# EasyEDA Pro project ProProject_aDataFlow_v2_pub_2024-01-13.epro, schematic SCH_back
Create Date: 2023-08-07; Page Name: P1; Project Name: aDataFlow_v2; Schematic Name: SCH_back; Update Date: 2023-09-15; Company: AMAGSTY; Drawed: amagsty; Page Size: -; Part Number: -; Reviewed: -; Version: 2.2
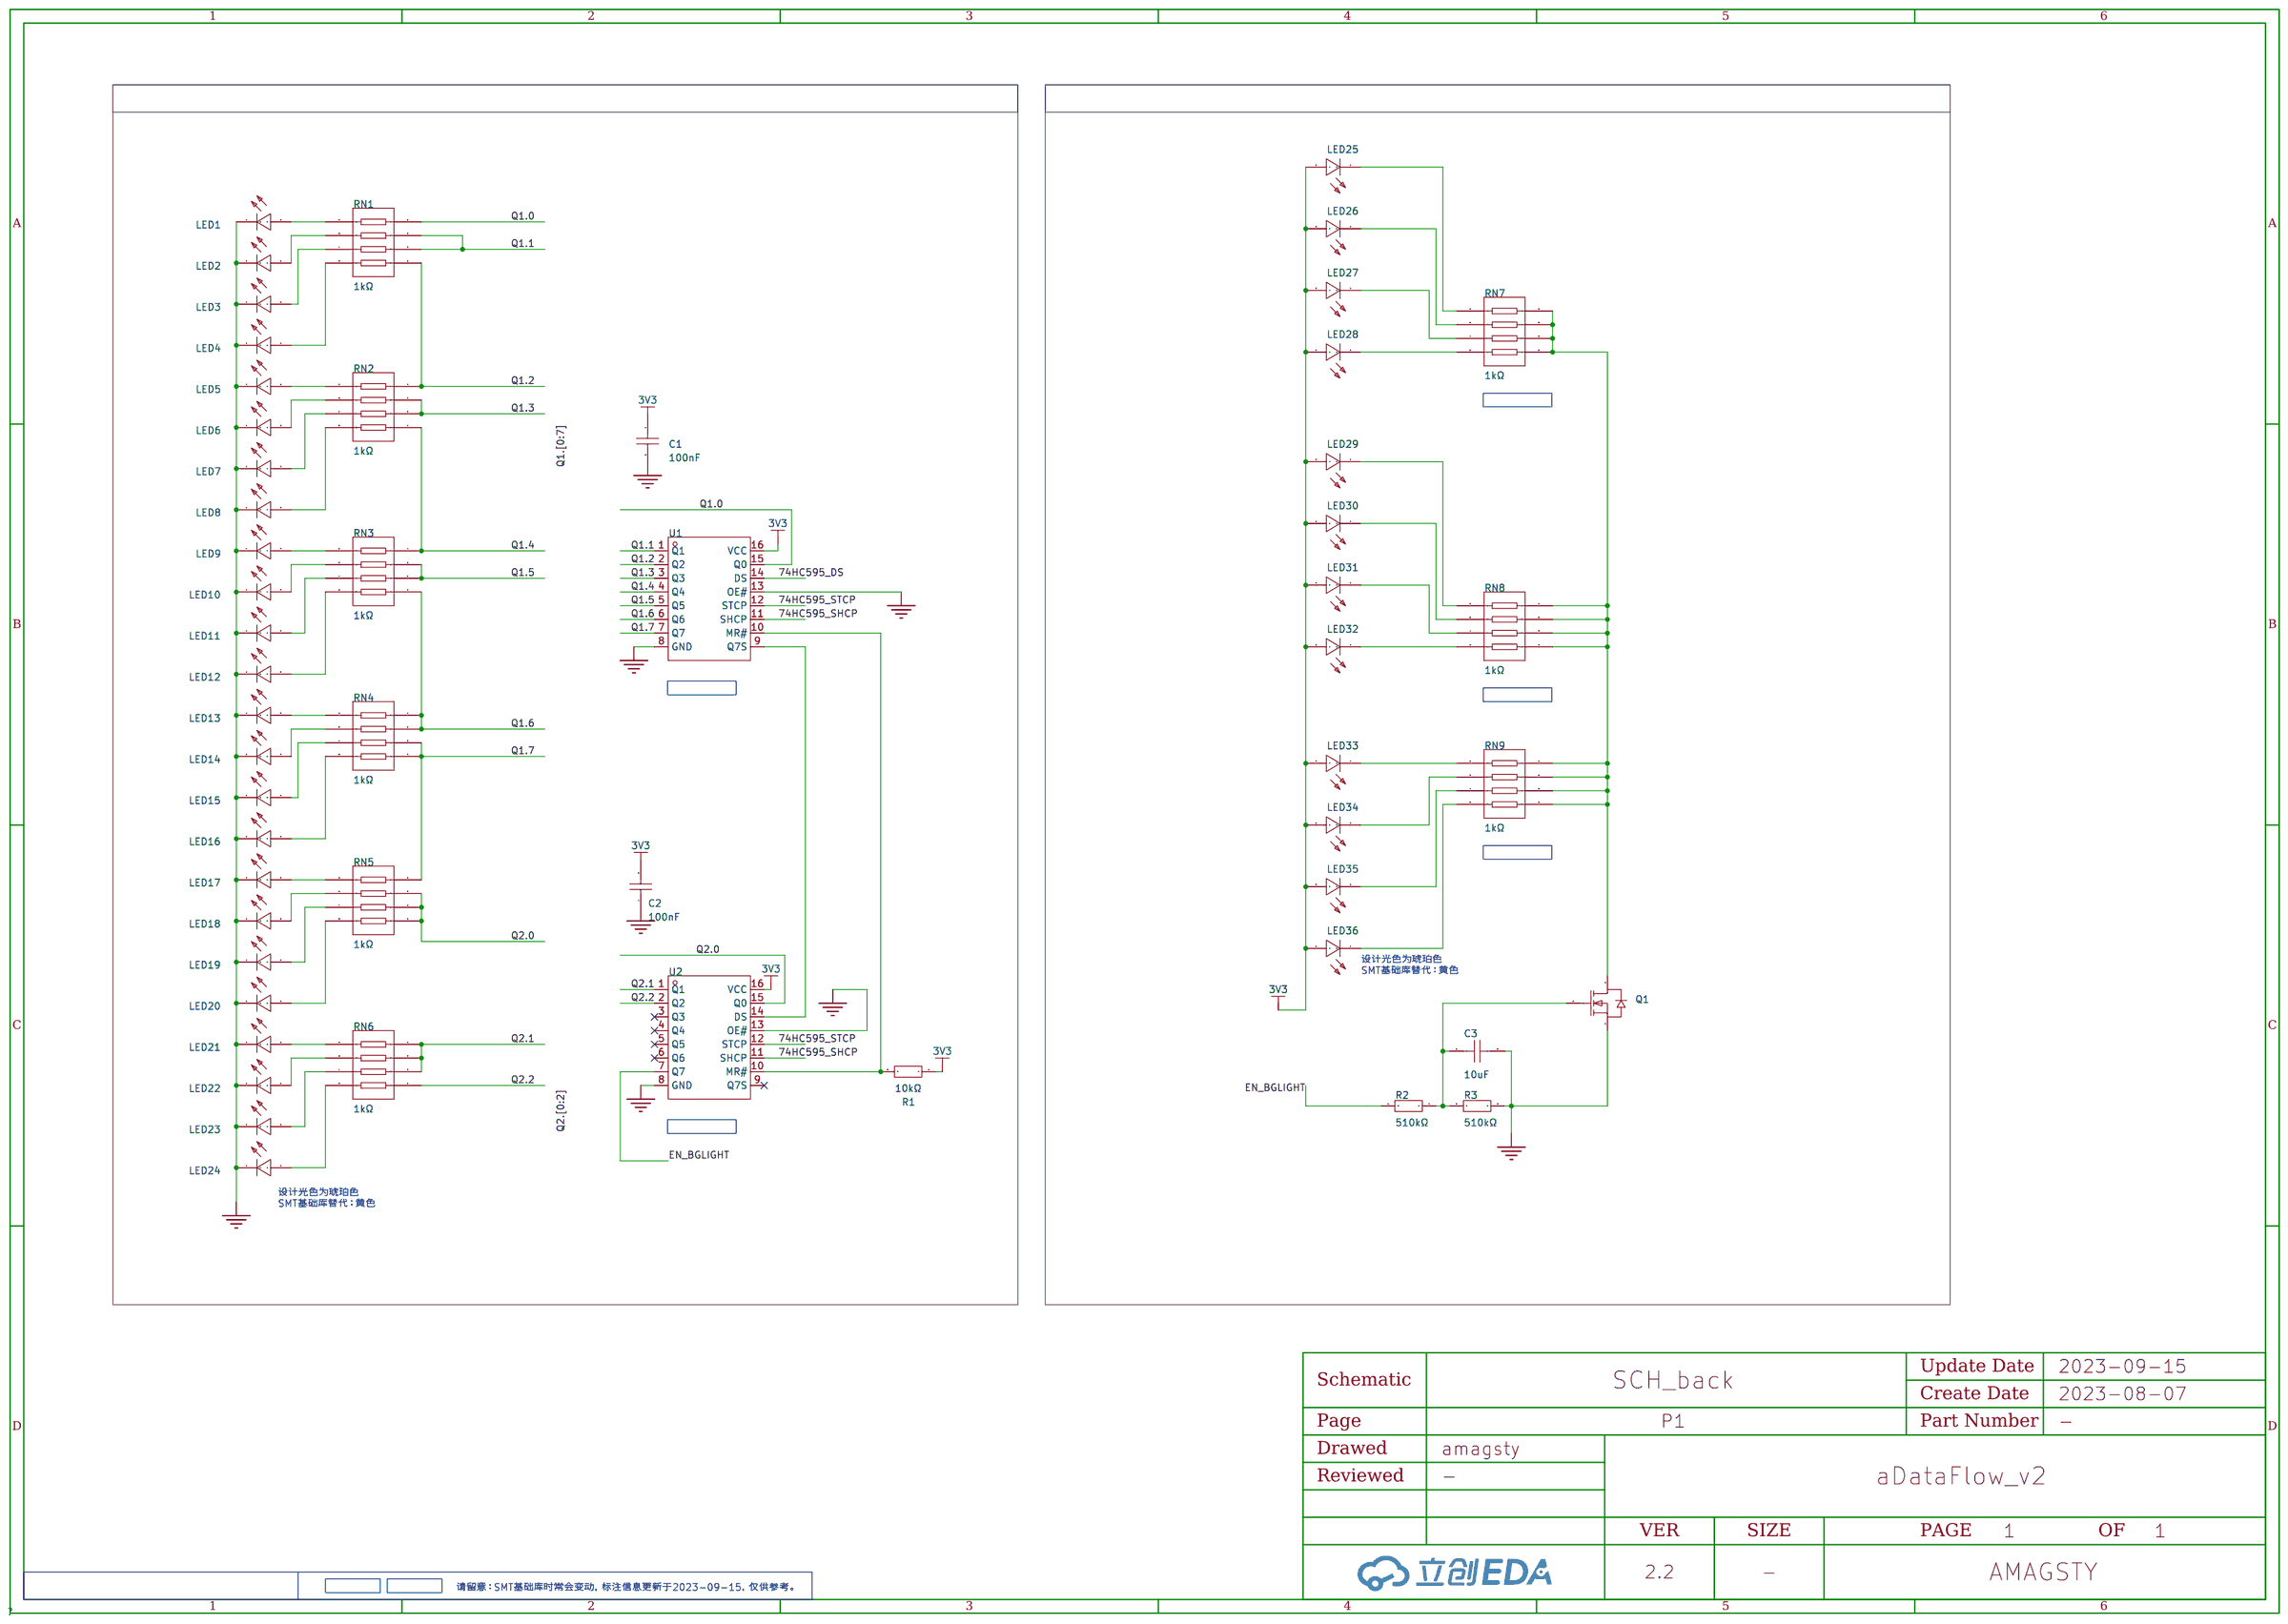
[diagram p1: schematic sheet]

## Parts
C1  100nF  [C0402]
C2  100nF  [C0402]
C3  10uF  [C0603]
LED1  19-213/Y2C-CQ2R2L/3T(CY)  [LED0603-RD-YELLOW]
LED2  19-213/Y2C-CQ2R2L/3T(CY)  [LED0603-RD-YELLOW]
LED3  19-213/Y2C-CQ2R2L/3T(CY)  [LED0603-RD-YELLOW]
LED4  19-213/Y2C-CQ2R2L/3T(CY)  [LED0603-RD-YELLOW]
LED5  19-213/Y2C-CQ2R2L/3T(CY)  [LED0603-RD-YELLOW]
LED6  19-213/Y2C-CQ2R2L/3T(CY)  [LED0603-RD-YELLOW]
LED7  19-213/Y2C-CQ2R2L/3T(CY)  [LED0603-RD-YELLOW]
LED8  19-213/Y2C-CQ2R2L/3T(CY)  [LED0603-RD-YELLOW]
LED9  19-213/Y2C-CQ2R2L/3T(CY)  [LED0603-RD-YELLOW]
LED10  19-213/Y2C-CQ2R2L/3T(CY)  [LED0603-RD-YELLOW]
LED11  19-213/Y2C-CQ2R2L/3T(CY)  [LED0603-RD-YELLOW]
LED12  19-213/Y2C-CQ2R2L/3T(CY)  [LED0603-RD-YELLOW]
LED13  19-213/Y2C-CQ2R2L/3T(CY)  [LED0603-RD-YELLOW]
LED14  19-213/Y2C-CQ2R2L/3T(CY)  [LED0603-RD-YELLOW]
LED15  19-213/Y2C-CQ2R2L/3T(CY)  [LED0603-RD-YELLOW]
LED16  19-213/Y2C-CQ2R2L/3T(CY)  [LED0603-RD-YELLOW]
LED17  19-213/Y2C-CQ2R2L/3T(CY)  [LED0603-RD-YELLOW]
LED18  19-213/Y2C-CQ2R2L/3T(CY)  [LED0603-RD-YELLOW]
LED19  19-213/Y2C-CQ2R2L/3T(CY)  [LED0603-RD-YELLOW]
LED20  19-213/Y2C-CQ2R2L/3T(CY)  [LED0603-RD-YELLOW]
LED21  19-213/Y2C-CQ2R2L/3T(CY)  [LED0603-RD-YELLOW]
LED22  19-213/Y2C-CQ2R2L/3T(CY)  [LED0603-RD-YELLOW]
LED23  19-213/Y2C-CQ2R2L/3T(CY)  [LED0603-RD-YELLOW]
LED24  19-213/Y2C-CQ2R2L/3T(CY)  [LED0603-RD-YELLOW]
LED25  19-213/Y2C-CQ2R2L/3T(CY)  [LED0603-RD-YELLOW]
LED26  19-213/Y2C-CQ2R2L/3T(CY)  [LED0603-RD-YELLOW]
LED27  19-213/Y2C-CQ2R2L/3T(CY)  [LED0603-RD-YELLOW]
LED28  19-213/Y2C-CQ2R2L/3T(CY)  [LED0603-RD-YELLOW]
LED29  19-213/Y2C-CQ2R2L/3T(CY)  [LED0603-RD-YELLOW]
LED30  19-213/Y2C-CQ2R2L/3T(CY)  [LED0603-RD-YELLOW]
LED31  19-213/Y2C-CQ2R2L/3T(CY)  [LED0603-RD-YELLOW]
LED32  19-213/Y2C-CQ2R2L/3T(CY)  [LED0603-RD-YELLOW]
LED33  19-213/Y2C-CQ2R2L/3T(CY)  [LED0603-RD-YELLOW]
LED34  19-213/Y2C-CQ2R2L/3T(CY)  [LED0603-RD-YELLOW]
LED35  19-213/Y2C-CQ2R2L/3T(CY)  [LED0603-RD-YELLOW]
LED36  19-213/Y2C-CQ2R2L/3T(CY)  [LED0603-RD-YELLOW]
Q1  AO3400A  [SOT-23-3_L2.9-W1.6-P1.90-LS2.8-BR]
R1  10kΩ  [R0402]
R2  510kΩ  [R0402]
R3  510kΩ  [R0402]
RN1  1kΩ  [RES-ARRAY-SMD_0603-8P-L3.2-W1.6-BL]
RN2  1kΩ  [RES-ARRAY-SMD_0603-8P-L3.2-W1.6-BL]
RN3  1kΩ  [RES-ARRAY-SMD_0603-8P-L3.2-W1.6-BL]
RN4  1kΩ  [RES-ARRAY-SMD_0603-8P-L3.2-W1.6-BL]
RN5  1kΩ  [RES-ARRAY-SMD_0603-8P-L3.2-W1.6-BL]
RN6  1kΩ  [RES-ARRAY-SMD_0603-8P-L3.2-W1.6-BL]
RN7  1kΩ  [RES-ARRAY-SMD_0603-8P-L3.2-W1.6-BL]
RN8  1kΩ  [RES-ARRAY-SMD_0603-8P-L3.2-W1.6-BL]
RN9  1kΩ  [RES-ARRAY-SMD_0603-8P-L3.2-W1.6-BL]
U1  74HC595D,118  [SOIC-16_L9.9-W3.9-P1.27-LS6.0-BL]
U2  74HC595D,118  [SOIC-16_L9.9-W3.9-P1.27-LS6.0-BL]

## Library data of the parts
C1 C2 = CL05B104KO5NNNC: 容值:100nF;精度:±10%;额定电压:16V;材质(温度系数):X7R;; LCSC Part Name: 100nF ±10% 16V; Supplier Part: C1525; Manufacturer: SAMSUNG(三星); Supplier Footprint: 0402; JLCPCB Part Class: 基础库; Datasheet: https://atta.szlcsc.com/upload/public/pdf/source/20160103/1457707674891.pdf; Supplier: LCSC; Tolerance: ±10%; Voltage Rated: 16V; Temperature Coefficient: X7R
C3 = CL10A106KP8NNNC: 容值:10uF;精度:±10%;额定电压:10V;材质(温度系数):X5R;; LCSC Part Name: 10uF ±10% 10V; Supplier Part: C19702; Manufacturer: SAMSUNG(三星); Supplier Footprint: 0603; JLCPCB Part Class: 基础库; Datasheet: https://atta.szlcsc.com/upload/public/pdf/source/20160103/1457707703378.pdf; Supplier: LCSC; Tolerance: ±10%; Voltage Rated: 10V; Temperature Coefficient: X5R
LED1-LED36 = 19-213/Y2C-CQ2R2L/3T(CY): 发光颜色:黄灯;二极管配置:-;主波长:585.5nm~591.5nm;色温:-;功率:60mW;安装方式:-;; LCSC Part Name: 黄灯; Supplier Part: C72038; Manufacturer: EVERLIGHT(亿光); Supplier Footprint: 0603; JLCPCB Part Class: 基础库; Datasheet: https://atta.szlcsc.com/upload/public/pdf/source/20160507/1462613613586.pdf; Supplier: LCSC; Emitted Color: 黄灯; Lens Color: 无色透明; Dominant Wavelength: 585.5nm~591.5nm; Peak Wavelength: 591nm; Forward Current: 20mA; Power Dissipation: 60mW; Viewing Angle: 120°; Operating Temperature: -40℃~+85℃
Q1 = AO3400A_C20917: 类型:N沟道;漏源电压(Vdss):30V;连续漏极电流(Id):5.7A;功率(Pd):1.4W;导通电阻(RDS(on)@Vgs,Id):26.5mΩ@10V,5.7A;; LCSC Part Name: N沟道 30V 5.7A; Supplier Part: C20917; Manufacturer: AOS; Supplier Footprint: SOT-23-3L; JLCPCB Part Class: Basic Part; Datasheet: https://atta.szlcsc.com/upload/public/pdf/source/20140107/1457706668533.pdf; Supplier: LCSC; Type: N沟道; Drain Source Voltage (Vdss): 30V; Continuous Drain Current (Id): 5.7A; Power Dissipation (Pd): 1.4W; Drain Source On Resistance (RDS(on)@Vgs,Id): 26.5mΩ@10V,5.7A; Gate Threshold Voltage (Vgs(th)@Id): 1.5V@250uA
R1 = 0402WGF1002TCE: 电阻类型:厚膜电阻;阻值:10kΩ;精度:±1%;功率:62.5mW;; LCSC Part Name: 10kΩ ±1% 62.5mW; Supplier Part: C25744; Manufacturer: UNI-ROYAL(厚声); Supplier Footprint: 0402; JLCPCB Part Class: 基础库; Datasheet: https://atta.szlcsc.com/upload/public/pdf/source/20200306/C422600_1E6D84923E4A46A82E41ADD87F860B5C.pdf; Supplier: LCSC; Type: 厚膜电阻; Tolerance: ±1%; Power(Watts): 62.5mW; Temperature Coefficient: ±100ppm/℃; Overload Voltage (Max): 50V; Operating Temperature Range: -55℃~+155℃
R2 R3 = 0402WGF5103TCE: 电阻类型:厚膜电阻;阻值:510kΩ;精度:±1%;功率:62.5mW;; LCSC Part Name: 510kΩ ±1% 62.5mW; Supplier Part: C11616; Manufacturer: UNI-ROYAL(厚声); Supplier Footprint: 0402; JLCPCB Part Class: 基础库; Datasheet: https://atta.szlcsc.com/upload/public/pdf/source/20200306/C422600_1E6D84923E4A46A82E41ADD87F860B5C.pdf; Supplier: LCSC; Type: 厚膜电阻; Tolerance: ±1%; Power(Watts): 62.5mW; Temperature Coefficient: ±100ppm/℃; Overload Voltage (Max): 50V; Operating Temperature Range: -55℃~+155℃
RN1-RN9 = 4D03WGJ0102T5E: 阻值:1kΩ;精度:±5%;单个元件功率:62.5mW;电阻器数:4;; LCSC Part Name: 1kΩ ±5%; Supplier Part: C20197; Manufacturer: UNI-ROYAL(厚声); Supplier Footprint: 0603x4; JLCPCB Part Class: 基础库; Datasheet: https://atta.szlcsc.com/upload/public/pdf/source/20170615/1497510986702.pdf; Supplier: LCSC; Tolerance: ±5%; Power(Watts): 62.5mW; Number of Resistors: 4; Number of Pins: 8; Temperature Coefficient: ±200ppm/℃
U1 U2 = 74HC595D,118: 功能:串行至串行或并行;电源电压:2V~6V;; LCSC Part Name: 三态输出 串行至串行或并行移位寄存器; Supplier Part: C5947; Manufacturer: Nexperia(安世); Supplier Footprint: SOIC-16; JLCPCB Part Class: 基础库; Datasheet: https://atta.szlcsc.com/upload/public/pdf/source/20140108/1457706668762.pdf; Supplier: LCSC; Series: 74HC; Output Type: 三态; Function: 串行至串行或并行; Supply Voltage: 2V~6V; Operating Temperature: -40℃~+125℃

## Nets
3V3: C1.1 C2.2 LED25.2(A) LED26.2(A) LED27.2(A) LED28.2(A) LED29.2(A) LED30.2(A) LED31.2(A) LED32.2(A) LED33.2(A) LED34.2(A) LED35.2(A) LED36.2(A) R1.1 U1.16(VCC) U2.16(VCC)
GND: C1.2 C2.1 C3.2 LED1.1(C) LED2.1(C) LED3.1(C) LED4.1(C) LED5.1(C) LED6.1(C) LED7.1(C) LED8.1(C) LED9.1(C) LED10.1(C) LED11.1(C) LED12.1(C) LED13.1(C) LED14.1(C) LED15.1(C) LED16.1(C) LED17.1(C) LED18.1(C) LED19.1(C) LED20.1(C) LED21.1(C) LED22.1(C) LED23.1(C) LED24.1(C) Q1.2(S) R3.1 U1.8(GND) U1.13(OE#) U2.8(GND) U2.13(OE#)
74HC595_DS: U1.14(DS)
74HC595_SHCP: U1.11(SHCP) U2.11(SHCP)
74HC595_STCP: U1.12(STCP) U2.12(STCP)
EN_BGLIGHT: R2.2 U2.7(Q7)
Q1.0: RN1.4 U1.15(Q0)
Q1.1: RN1.2 RN1.3 U1.1(Q1)
Q1.2: RN1.1 RN2.4 U1.2(Q2)
Q1.3: RN2.2 RN2.3 U1.3(Q3)
Q1.4: RN2.1 RN3.4 U1.4(Q4)
Q1.5: RN3.2 RN3.3 U1.5(Q5)
Q1.6: RN3.1 RN4.3 RN4.4 U1.6(Q6)
Q1.7: RN4.1 RN4.2 RN5.4 U1.7(Q7)
Q2.0: RN5.1 RN5.2 RN5.3 U2.15(Q0)
Q2.1: RN6.2 RN6.3 RN6.4 U2.1(Q1)
Q2.2: RN6.1 U2.2(Q2)
$1N5946: U1.9(Q7S) U2.14(DS)
$1N13270: R1.2 U1.10(MR#) U2.10(MR#)
$1N16986: LED36.1(C) RN9.8
$1N16996: LED35.1(C) RN9.7
$1N17001: LED34.1(C) RN9.6
$1N17009: LED33.1(C) RN9.5
$1N17013: LED32.1(C) RN8.8
$1N17019: LED31.1(C) RN8.7
$1N17029: LED30.1(C) RN8.6
$1N17039: LED29.1(C) RN8.5
$1N17049: LED28.1(C) RN7.8
$1N17059: LED27.1(C) RN7.7
$1N17064: LED26.1(C) RN7.6
$1N17074: LED25.1(C) RN7.5
$1N17102: Q1.3(D) RN7.1 RN7.2 RN7.3 RN7.4 RN8.1 RN8.2 RN8.3 RN8.4 RN9.1 RN9.2 RN9.3 RN9.4
$1N17396: LED1.2(A) RN1.5
$1N17404: LED2.2(A) RN1.6
$1N17414: LED3.2(A) RN1.7
$1N17419: LED4.2(A) RN1.8
$1N17481: LED5.2(A) RN2.5
$1N17484: LED6.2(A) RN2.6
$1N17494: LED7.2(A) RN2.7
$1N17499: LED8.2(A) RN2.8
$1N17561: LED9.2(A) RN3.5
$1N17564: LED10.2(A) RN3.6
$1N17628: LED11.2(A) RN3.7
$1N17633: LED12.2(A) RN3.8
$1N17637: LED13.2(A) RN4.5
$1N17659: LED14.2(A) RN4.6
$1N17663: LED15.2(A) RN4.7
$1N17673: LED16.2(A) RN4.8
$1N17745: LED17.2(A) RN5.5
$1N17748: LED18.2(A) RN5.6
$1N17752: LED19.2(A) RN5.7
$1N17828: LED20.2(A) RN5.8
$1N17838: LED21.2(A) RN6.5
$1N17848: LED22.2(A) RN6.6
$1N17875: LED23.2(A) RN6.7
$1N23289: C3.1 Q1.1(G) R2.1 R3.2
$1N26698: LED24.2(A) RN6.8

Not connected (* = marked no-connect by the designer): U2 3(Q3)* 4(Q4)* 5(Q5)* 6(Q6)* 9(Q7S)*

## Notes on the sheet
- INDICATORS
- BACKLIGHT
- SMT_BASE
- SMT_BASE
- SMT_BASE
- SMT_BASE
- 设计光色为琥珀色
  SMT基础库替代：黄色
- SMT_BASE
- 设计光色为琥珀色
  SMT基础库替代：黄色
- SMT_BASE
- SMT_EXT
- PCB: 黑色，1.0mm
- 请留意：SMT基础库时常会变动，标注信息更新于2023-09-15，仅供参考。
